# EasyEDA Pro project ProPrj_New Project_2025-04-16_15-56-37_2025-04-18.epro

# Schematic Schematic1
Board Name: Board1; Create Date: 2025-04-16; Page Name: P1; Project Name: New Project_2025-04-16_15-56-37; Schematic Name: Schematic1; Update Date: 2025-04-17; Company: 嘉立创EDA; Page Size: A4; Version: V1.0
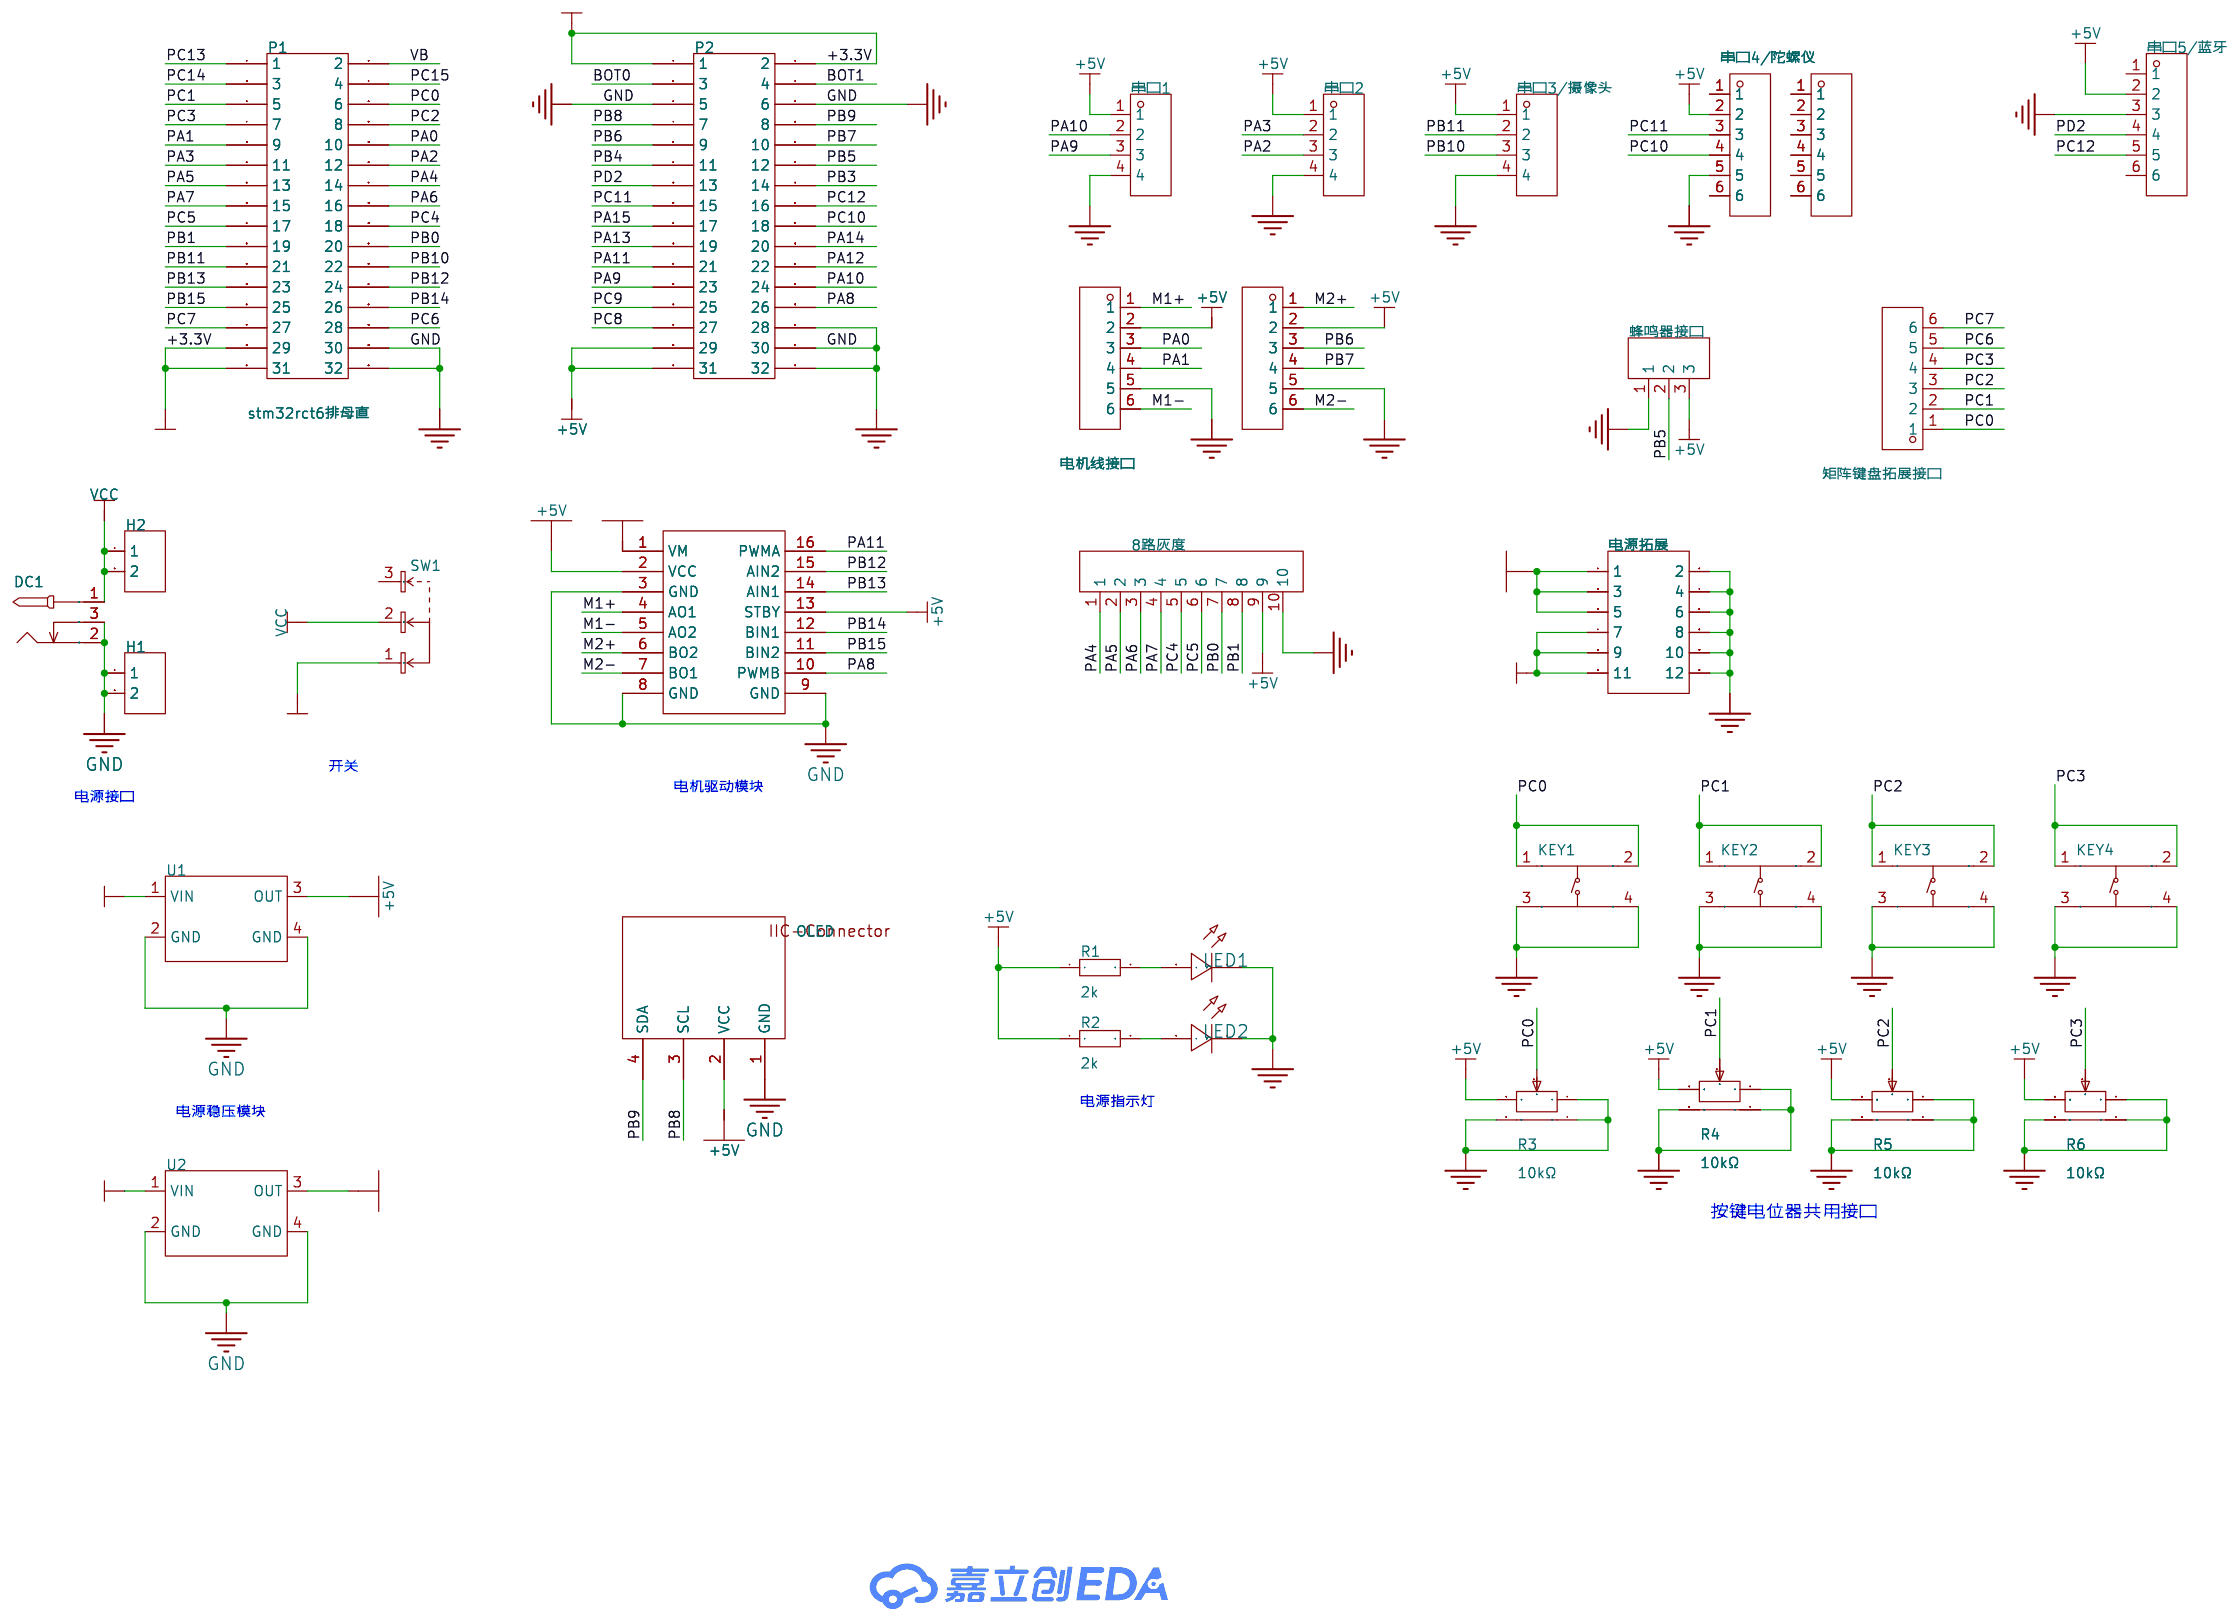
[diagram p0: schematic sheet]

## Parts
8路灰度  -  [HDR-TH_10P-P2.54-V-F]
DC1  -  [DC-005_2.5]
H1  -  [HDR-TH_2P-P2.54-V-F]
H2  -  [HDR-TH_2P-P2.54-V-F]
H8  -  [HDR-TH_6P-P2.54-V-F]
KEY1  TS665CJ  [SW-TH_4P-L6.0-W6.0-P4.50-LS6.5]
KEY2  TS665CJ  [SW-TH_4P-L6.0-W6.0-P4.50-LS6.5]
KEY3  TS665CJ  [SW-TH_4P-L6.0-W6.0-P4.50-LS6.5]
KEY4  TS665CJ  [SW-TH_4P-L6.0-W6.0-P4.50-LS6.5]
LED1  -  [LED_0603]
LED2  -  [LED_0603]
OLED  -  [0.96OLED_4P]
P1  stm32rct6排母直  [HDR-TH_32P-P2.54-V-F-R2-C16-S2.54]
P2  stm32rct6排母直  [HDR-TH_32P-P2.54-V-F-R2-C16-S2.54]
R1  2k  [R0603]
R2  2k  [R0603]
R3  10kΩ  [RV0932电位器]
R4  10kΩ  [RV0932电位器]
R5  10kΩ  [RV0932电位器]
R6  10kΩ  [RV0932电位器]
SW1  SS-12D06L5  [SW-TH_3P-P4.70_L11.1-W12.7]
U1  -  [MP1584模块]
U2  -  [MP1584模块]
U3  PH2.0-6P  [PH2.0-6P 直针端子座]
U5  -  [TB6612FNG Module - 8pin x 2]
串口1  -  [HDR-TH_4P-P2.54-V-F]
串口2  -  [HDR-TH_4P-P2.54-V-F]
串口3/摄像头  -  [HDR-TH_4P-P2.54-V-F]
串口4/陀螺仪  -  [HDR-TH_6P-P2.54-V-F]
串口5/蓝牙  -  [HDR-TH_6P-P2.54-V-F]
电机线接口  PH2.0-6P  [PH2.0-6P 直针端子座]
电源拓展  -  [HDR-TH_12P-P2.54-V-M-R2-C6-S2.54]
矩阵键盘拓展接口  -  [HDR-TH_6P-P2.54-V-F]
蜂鸣器接口  -  [HDR-TH_3P-P2.54-V-F]

## Library data of the parts
8路灰度 = HDR-F_2.54_1x10P: Supplier Part: C2684744; Supplier Footprint: 插件
DC1 = DC-005_2.5: Supplier Footprint: 插件
H1 H2 = HDR-F_2.54_1x2P: Supplier Part: C49661; Supplier Footprint: 插件
H8 串口4/陀螺仪 串口5/蓝牙 矩阵键盘拓展接口 = HDR-F_2.54_1x6P: Supplier Part: C40877; Supplier Footprint: 插件
KEY1-KEY4 = TS665CJ: 电路结构:单刀单掷;按钮形状:圆形按钮;安装方式:直插;开关长度:6mm;开关宽度:6mm;开关高度:5mm;触点电流:50mA;额定电压(DC):12V;带灯:-;机械寿命:-;; LCSC Part Name: 6*6*5mm 直插 轻触开关; Supplier Part: C393938; Manufacturer: SHOU HAN(首韩); Supplier Footprint: 插件; JLCPCB Part Class: 扩展库; Datasheet: https://atta.szlcsc.com/upload/public/pdf/source/20190521/C393938_BDABEAC600B4C55E200A80AA129B70BC.pdf; Supplier: LCSC; Circuit: 单刀单掷; Actuator Style: 圆形按钮; Mounting Style: 直插; Switch Length: 6mm; Switch Width: 6mm; Switch Height: 5mm; Contact Current: 50mA; Voltage Rating (DC): 12V
LED1 LED2 = LED_0603-R: Supplier Footprint: 0603
OLED = 0.96OLED_4P: LCSC Part Name: 0.96OLED_4P_MODULE_JX; Supplier Part: C9900004566; Manufacturer Part: 0.96OLED_4P_MODULE_JX; Supplier Footprint: THrough hole; JLCPCB Part Class: Extended Part; Supplier: LCSC
P1 P2 = 2.54mm,2×16双排排母直: 圆针/方针:-;额定电流:-;额定电压:-;配合针长度:-;塑高:-;触头材质:-;; Supplier Part: C55795; Supplier Footprint: 2.54mm; JLCPCB Part Class: 扩展库; Supplier: LCSC
R1 R2 = Res_0603: Supplier Footprint: 0603
R3-R6 = RK09K1130AP5: 阻值:10kΩ;精度:±20%;功率:50mW;; LCSC Part Name: 10kΩ ±20%; Supplier Part: C470295; Manufacturer: ALPSALPINE(阿尔卑斯阿尔派); Supplier Footprint: 插件; JLCPCB Part Class: 扩展库; Datasheet: https://atta.szlcsc.com/upload/public/pdf/source/20191216/C470452_A95F493F84F2A4E5D2456A617FF6269D.pdf; Supplier: LCSC; Tolerance: ±20%; Rated Voltage: 20V; Power(Watts): 50mW
SW1 = SS-12D06L5: 电路结构:单刀双掷;安装方式:侧插;开关颜色:黑色;额定电流(DC):3A;额定电压(DC):250V;额定电流(AC):3A;额定电压(AC):250V;机械寿命:1万次;; LCSC Part Name: 柄长5mm 卧插双档 滑动开关; Supplier Part: C319015; Manufacturer: XKB Connectivity(中国星坤); Supplier Footprint: 插件; JLCPCB Part Class: 扩展库; Datasheet: https://atta.szlcsc.com/upload/public/pdf/source/20211009/0D67854FD60FB1F6FE75130AD47C052C.pdf; Supplier: LCSC; Circuit: 单刀双掷; Actuator Style: 矩形柱状; Pin Style: PC引脚; Switch Length: 12.95mm; Switch Width: 6.6mm; Switch Height: 6.3mm; Mounting Style: 侧插; Actuator Color: 黑色; Current Rating (DC): 3A; Voltage Rating (DC): 250V; Current Rating (AC): 3A; Voltage Rating (AC): 250V; Mechanical Life: 1万次; Operating Temperature: -40℃~+85℃
U1 U2 = MP1584模块: Pin Type: IN
U3 电机线接口 = PH2.0-6P: Pin Type: IN; Supplier: LCSC; Supplier Part: C722763; Manufacturer: CAX(创都); Manufacturer Part: PH2.0-4P; JLCPCB Part Class: Extended Part
U5 = TB6612FNG模块: Pin Type: In
串口1 串口2 串口3/摄像头 = HDR-F_2.54_1x4P: Supplier Part: C2718488; Supplier Footprint: 插件
电源拓展 = HDR-F_2.54_2x6
蜂鸣器接口 = HDR-F_2.54_1x3P: Supplier Part: C541850; Supplier Footprint: 插件

## Nets
5V: U2.3(OUT) 电源拓展.1 电源拓展.3 电源拓展.5
+3.3V: P1.29 P1.31 P2.1 P2.2 电源拓展.7 电源拓展.9 电源拓展.11
+5V: 8路灰度.9 OLED.2(VCC) P2.29 P2.31 R1.1 R2.1 R3.3 R4.3 R5.3 R6.3 U1.3(OUT) U3.2 U5.2(VCC) U5.13(STBY) 串口1.1 串口2.1 串口3/摄像头.1 串口4/陀螺仪.2 串口5/蓝牙.2 电机线接口.2 蜂鸣器接口.3
+12V: SW1.1 U1.1(VIN) U2.1(VIN) U5.1(VM)
GND: 8路灰度.10 DC1.2 DC1.3 H1.1 H1.2 KEY1.3(C) KEY1.4(D) KEY2.3(C) KEY2.4(D) KEY3.3(C) KEY3.4(D) KEY4.3(C) KEY4.4(D) LED1.1(C) LED2.1(C) OLED.1(GND) P1.30 P1.32 P2.5 P2.6 P2.28 P2.30 P2.32 R3.1 R3.4 R3.5 R4.1 R4.4 R4.5 R5.1 R5.4 R5.5 R6.1 R6.4 R6.5 U1.2(GND) U1.4(GND) U2.2(GND) U2.4(GND) U3.5 U5.3(GND) U5.8(GND) U5.9(GND) 串口1.4 串口2.4 串口3/摄像头.4 串口4/陀螺仪.5 串口5/蓝牙.3 电机线接口.5 电源拓展.2 电源拓展.4 电源拓展.6 电源拓展.8 电源拓展.10 电源拓展.12 蜂鸣器接口.1
VCC: DC1.1(4) H2.1 H2.2 SW1.2
BOT0: P2.3
BOT1: P2.4
M1+: U3.1 U5.4(AO1)
M1-: U3.6 U5.5(AO2)
M2+: U5.6(BO2) 电机线接口.1
M2-: U5.7(BO1) 电机线接口.6
PA0: P1.10 U3.3
PA1: P1.9 U3.4
PA2: P1.12 串口2.3
PA3: P1.11 串口2.2
PA4: 8路灰度.1 P1.14
PA5: 8路灰度.2 P1.13
PA6: 8路灰度.3 P1.16
PA7: 8路灰度.4 P1.15
PA8: P2.26 U5.10(PWMB)
PA9: P2.23 串口1.3
PA10: P2.24 串口1.2
PA11: P2.21 U5.16(PWMA)
PA12: P2.22
PA13: P2.19
PA14: P2.20
PA15: P2.17
PB0: 8路灰度.7 P1.20
PB1: 8路灰度.8 P1.19
PB3: P2.14
PB4: P2.11
PB5: P2.12 蜂鸣器接口.2
PB6: P2.9 电机线接口.3
PB7: P2.10 电机线接口.4
PB8: OLED.3(SCL) P2.7
PB9: OLED.4(SDA) P2.8
PB10: P1.22 串口3/摄像头.3
PB11: P1.21 串口3/摄像头.2
PB12: P1.24 U5.15(AIN2)
PB13: P1.23 U5.14(AIN1)
PB14: P1.26 U5.12(BIN1)
PB15: P1.25 U5.11(BIN2)
PC0: KEY1.1(A) KEY1.2(B) P1.6 R3.2 矩阵键盘拓展接口.1
PC1: KEY2.1(A) KEY2.2(B) P1.5 R4.2 矩阵键盘拓展接口.2
PC2: KEY3.1(A) KEY3.2(B) P1.8 R5.2 矩阵键盘拓展接口.3
PC3: KEY4.1(A) KEY4.2(B) P1.7 R6.2 矩阵键盘拓展接口.4
PC4: 8路灰度.5 P1.18
PC5: 8路灰度.6 P1.17
PC6: P1.28 矩阵键盘拓展接口.5
PC7: P1.27 矩阵键盘拓展接口.6
PC8: P2.27
PC9: P2.25
PC10: P2.18 串口4/陀螺仪.4
PC11: P2.15 串口4/陀螺仪.3
PC12: P2.16 串口5/蓝牙.5
PC13: P1.1
PC14: P1.3
PC15: P1.4
PD2: P2.13 串口5/蓝牙.4
VB: P1.2
$1N9020: LED1.2(A) R1.2
$1N9024: LED2.2(A) R2.2

Not connected (* = marked no-connect by the designer): H8 1 2 3 4 5 6; SW1 3; 串口4/陀螺仪 1 6; 串口5/蓝牙 1 6

## Notes on the sheet
- 开关
- 电源接口
- 电机驱动模块
- 电源稳压模块
- 电源指示灯
- 按键电位器共用接口

# Board PCB1
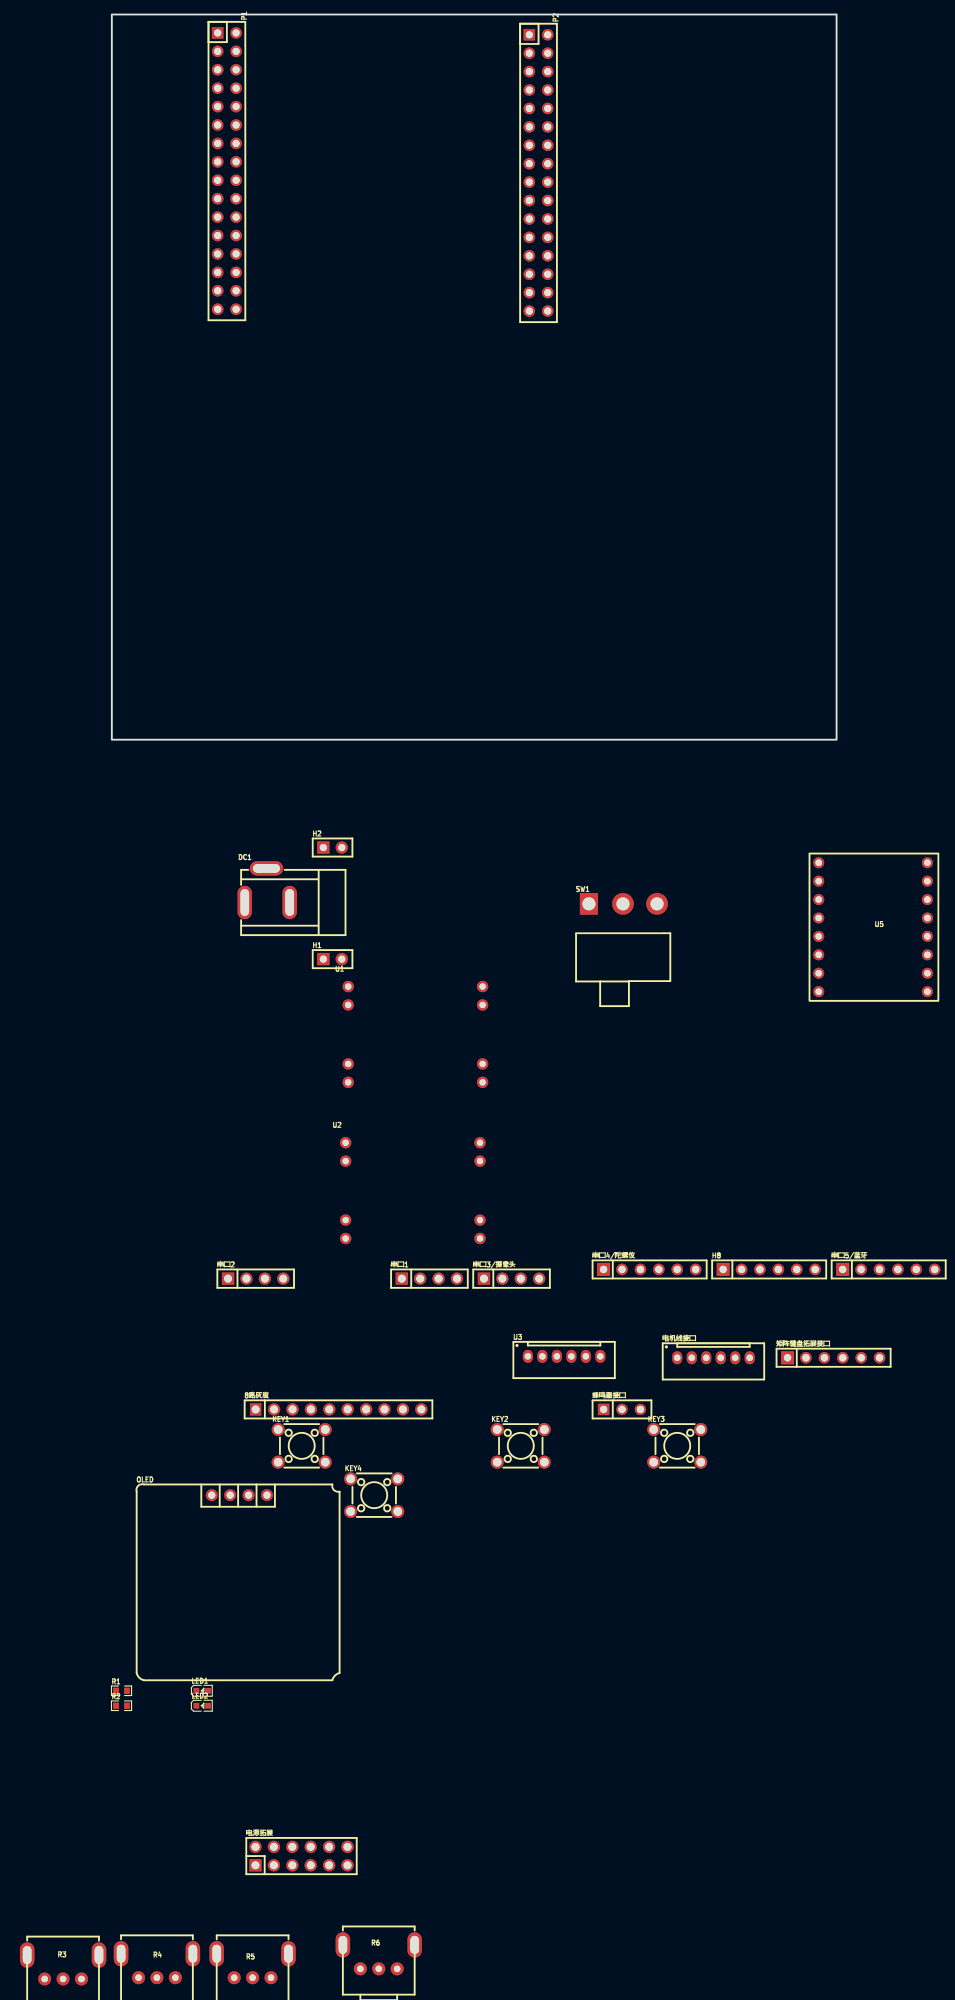
[diagram p1: board, top side]
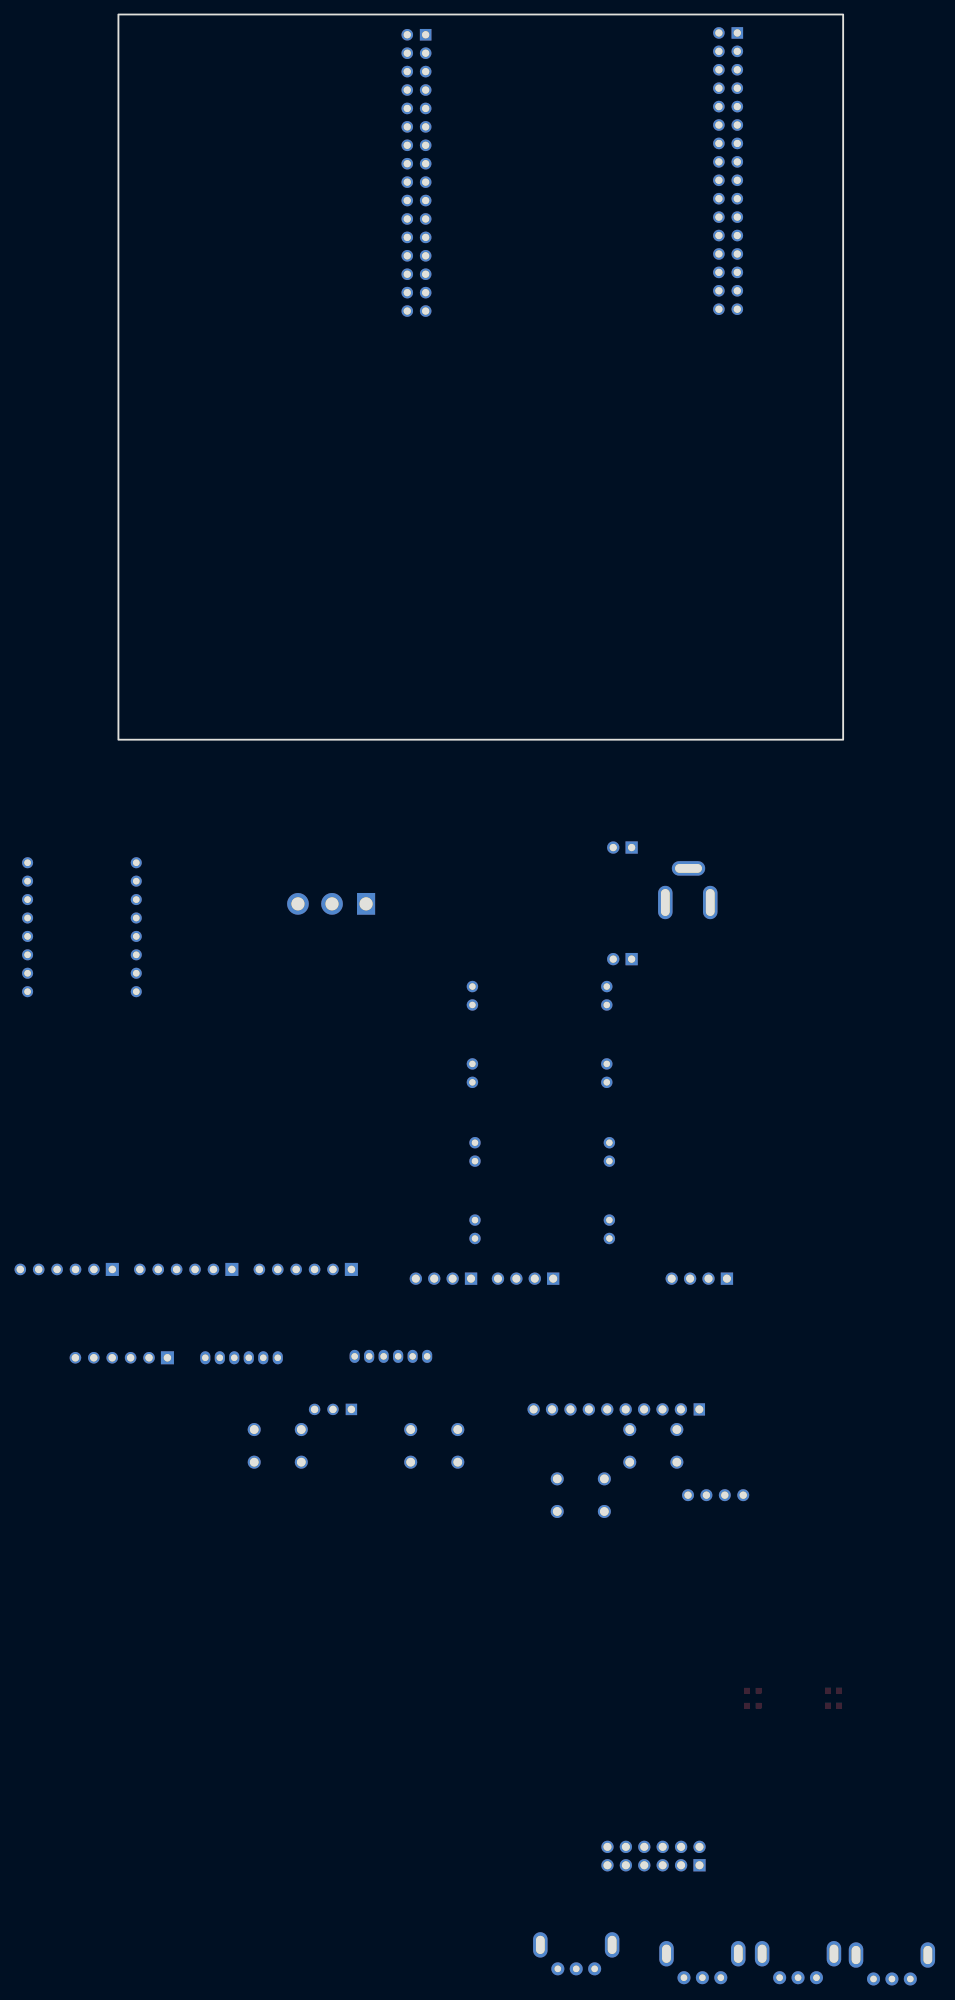
[diagram p2: board, bottom side, seen from below]

Outline 100 x 100 mm; copper layers: Top Layer, Bottom Layer. Coordinates in mm from the lower left corner of the outline.
Outline path: rectangle 0,100 100,0
Stack: Top Layer 0.035mm / Dielectric1 1.51mm FR4 er 4.5 / Bottom Layer 0.035mm

## Design rules (mm)
template: JLCPCB Capability(Two Layers Board)
spacing copperThickness1oz (default): track to track 0.102, other pairs 0.152 to 0.3
spacing copperThickness2oz: track to track 0.203, other pairs 0.152 to 0.3
track width copperThickness1oz (default): min 0.127, default 0.254, max 2.54
track width copperThickness2oz: min 0.203, default 0.254, max 2.54
differential pair differentialPair (default): width min 0.127, default 0.254, max 2.54; gap min 0.152, default 0.152
via viaSize (default): diameter min 0.5, default 0.61, max 10; hole min 0.3, default 0.305, max 6.3

## Placement (name value [footprint] x y rotation side)
8路灰度  -  [HDR-TH_10P-P2.54-V-F]  31.28 -92.35 0 top
DC1  -  [DC-005_2.5]  21.56 -22.13 0 top
H1  -  [HDR-TH_2P-P2.54-V-F]  30.45 -30.26 0 top
H2  -  [HDR-TH_2P-P2.54-V-F]  30.45 -14.87 0 top
H8  -  [HDR-TH_6P-P2.54-V-F]  90.7 -73.05 0 top
KEY1  TS665CJ  [SW-TH_4P-L6.0-W6.0-P4.50-LS6.5]  26.2 -97.38 0 top
KEY2  TS665CJ  [SW-TH_4P-L6.0-W6.0-P4.50-LS6.5]  56.42 -97.38 0 top
KEY3  TS665CJ  [SW-TH_4P-L6.0-W6.0-P4.50-LS6.5]  78.01 -97.38 0 top
KEY4  TS665CJ  [SW-TH_4P-L6.0-W6.0-P4.50-LS6.5]  36.2 -104.18 0 top
LED1  -  [LED_0603]  12.52 -131.15 0 top
LED2  -  [LED_0603]  12.52 -133.21 0 top
OLED  -  [0.96OLED_4P]  17.6 -104.18 0 top
P1  stm32rct6排母直  [HDR-TH_32P-P2.54-V-F-R2-C16-S2.54]  15.88 78.41 270 top
P2  stm32rct6排母直  [HDR-TH_32P-P2.54-V-F-R2-C16-S2.54]  58.88 78.16 270 top
R1  2k  [R0603]  1.33 -131.15 0 top
R2  2k  [R0603]  1.33 -133.21 0 top
R3  10kΩ  [RV0932电位器]  -6.73 -170.89 0 top
R4  10kΩ  [RV0932电位器]  6.22 -170.71 0 top
R5  10kΩ  [RV0932电位器]  19.42 -170.71 0 top
R6  10kΩ  [RV0932电位器]  36.83 -169.49 0 top
SW1  SS-12D06L5  [SW-TH_3P-P4.70_L11.1-W12.7]  70.53 -22.64 0 top
U1  -  [MP1584模块]  41.88 -40.65 0 top
U2  -  [MP1584模块]  41.53 -62.18 0 top
U3  PH2.0-6P  [PH2.0-6P 直针端子座]  57.4 -85.04 0 top
U5  -  [TB6612FNG Module - 8pin x 2]  105.16 -25.86 0 top
串口1  -  [HDR-TH_4P-P2.54-V-F]  43.82 -74.32 0 top
串口2  -  [HDR-TH_4P-P2.54-V-F]  19.85 -74.32 0 top
串口3/摄像头  -  [HDR-TH_4P-P2.54-V-F]  55.15 -74.32 0 top
串口4/陀螺仪  -  [HDR-TH_6P-P2.54-V-F]  74.2 -73.05 0 top
串口5/蓝牙  -  [HDR-TH_6P-P2.54-V-F]  107.19 -73.05 0 top
电机线接口  PH2.0-6P  [PH2.0-6P 直针端子座]  78.01 -85.23 0 top
电源拓展  -  [HDR-TH_12P-P2.54-V-M-R2-C6-S2.54]  26.17 -153.94 0 top
矩阵键盘拓展接口  -  [HDR-TH_6P-P2.54-V-F]  99.59 -85.23 0 top
蜂鸣器接口  -  [HDR-TH_3P-P2.54-V-F]  70.39 -92.35 0 top

## Footprints (pads in the part's own frame, mm; a bottom-side part is the same pattern mirrored in y, then rotated)
0.96OLED_4P
  round 1.651 hole 1.001: 1(-3.81,0) 2(-1.27,0.003) 3(1.27,0.003) 4(3.81,0.003)
DC-005_2.5
  oval 2x4.6 hole 1.2x3.7: 1(-3.227,-0.318) 2(2.973,-0.318)
  oval 4.6x2 hole 3.7x1.2: 3(-0.227,4.382)
HDR-TH_2P-P2.54-V-F
  rect 1.7x1.7 hole 1: 1(-1.27,0)
  round 1.7 hole 1: 2(1.27,0)
HDR-TH_3P-P2.54-V-F
  rect 1.575x1.575 hole 1.02: 1(-2.54,0)
  round 1.575 hole 1.02: 2(0,0) 3(2.54,0)
HDR-TH_4P-P2.54-V-F
  rect 1.7x1.7 hole 1.1: 1(-3.81,0)
  round 1.7 hole 1.1: 2(-1.27,0) 3(1.27,0) 4(3.81,0)
HDR-TH_6P-P2.54-V-F
  rect 1.8x1.8 hole 1.02: 1(-6.35,0)
  round 1.6 hole 1.02: 2(-3.81,0) 3(-1.27,0) 4(1.27,0) 5(3.81,0) 6(6.35,0)
HDR-TH_10P-P2.54-V-F
  rect 1.575x1.7 hole 1.1: 1(-11.43,0)
  round 1.7 hole 1.1: 2(-8.89,0) 3(-6.35,0) 4(-3.81,0) 5(-1.27,0) 6(1.27,0) 7(3.81,0) 8(6.35,0) 9(8.89,0) 10(11.43,0)
HDR-TH_12P-P2.54-V-M-R2-C6-S2.54
  rect 1.7x1.7 hole 1.1: 1(-6.35,-1.27)
  round 1.7 hole 1.1: 2(-6.35,1.27) 3(-3.81,-1.27) 4(-3.81,1.27) 5(-1.27,-1.27) 6(-1.27,1.27) 7(1.27,-1.27) 8(1.27,1.27) 9(3.81,-1.27) 10(3.81,1.27) 11(6.35,-1.27) 12(6.35,1.27)
HDR-TH_32P-P2.54-V-F-R2-C16-S2.54
  rect 1.6x1.6 hole 1: 1(-19.05,-1.27)
  round 1.6 hole 1: 2(-19.05,1.27) 3(-16.51,-1.27) 4(-16.51,1.27) 5(-13.97,-1.27) 6(-13.97,1.27) 7(-11.43,-1.27) 8(-11.43,1.27) 9(-8.89,-1.27) 10(-8.89,1.27) 11(-6.35,-1.27) 12(-6.35,1.27) 13(-3.81,-1.27) 14(-3.81,1.27) 15(-1.27,-1.27) 16(-1.27,1.27) 17(1.27,-1.27) 18(1.27,1.27) 19(3.81,-1.27) 20(3.81,1.27) 21(6.35,-1.27) 22(6.35,1.27) 23(8.89,-1.27) 24(8.89,1.27) 25(11.43,-1.27) 26(11.43,1.27) 27(13.97,-1.27) 28(13.97,1.27) 29(16.51,-1.27) 30(16.51,1.27) 31(19.05,-1.27) 32(19.05,1.27)
LED_0603
  rect 0.8x0.8 smd: 1(-0.851,-0.01) 2(0.75,-0.005)
MP1584模块
  round 1.575 hole 0.889: 1(-9.271,-4.064) 1(-9.271,-6.604) 2(-9.271,6.604) 2(-9.271,4.064) 3(9.271,-4.064) 3(9.271,-6.604) 4(9.271,6.604) 4(9.271,4.064)
PH2.0-6P 直针端子座
  oval 1.4x1.8 hole 0.9: 1(0,0) 2(2,0) 3(4,0) 4(6,0) 5(8,0) 6(10,0)
R0603
  rect 0.806x0.864 smd: 1(-0.753,0) 2(0.753,0)
RV0932电位器
  round 1.8 hole 0.914: 1(-2.54,0) 2(0,0) 3(2.54,0)
  oval 2x3.5 hole 1.2x2.5: 4(-4.953,3.302) 4(4.953,3.302)
SW-TH_3P-P4.70_L11.1-W12.7
  rect 2.5x3 hole 1.8: 1(-4.7,0)
  round 3 hole 1.8: 2(0,0) 3(4.7,0)
SW-TH_4P-L6.0-W6.0-P4.50-LS6.5
  round 1.8 hole 1.2: 1(-3.25,2.25) 2(3.25,2.25) 3(-3.25,-2.25) 4(3.25,-2.25)
TB6612FNG Module - 8pin x 2
  round 1.524 hole 0.914: 1(-7.62,8.89) 2(-7.62,6.35) 3(-7.62,3.81) 4(-7.62,1.27) 5(-7.62,-1.27) 6(-7.62,-3.81) 7(-7.62,-6.35) 8(-7.62,-8.89) 9(7.38,-8.89) 10(7.38,-6.35) 11(7.38,-3.81) 12(7.38,-1.27) 13(7.38,1.27) 14(7.38,3.81) 15(7.38,6.35) 16(7.38,8.89)

## Nets
5V: U2.3 电源拓展.1 电源拓展.3 电源拓展.5
+3.3V: P1.29 P1.31 P2.1 P2.2 电源拓展.7 电源拓展.9 电源拓展.11
+5V: 8路灰度.9 OLED.2 P2.29 P2.31 R1.1 R2.1 R3.3 R4.3 R5.3 R6.3 U1.3 U3.2 U5.2 U5.13 串口1.1 串口2.1 串口3/摄像头.1 串口4/陀螺仪.2 串口5/蓝牙.2 电机线接口.2 蜂鸣器接口.3
+12V: SW1.1 U1.1 U2.1 U5.1
GND: 8路灰度.10 DC1.2 DC1.3 H1.1 H1.2 KEY1.3 KEY1.4 KEY2.3 KEY2.4 KEY3.3 KEY3.4 KEY4.3 KEY4.4 LED1.1 LED2.1 OLED.1 P1.30 P1.32 P2.5 P2.6 P2.28 P2.30 P2.32 R3.1 R3.4 R4.1 R4.4 R5.1 R5.4 R6.1 R6.4 U1.2 U1.4 U2.2 U2.4 U3.5 U5.3 U5.8 U5.9 串口1.4 串口2.4 串口3/摄像头.4 串口4/陀螺仪.5 串口5/蓝牙.3 电机线接口.5 电源拓展.2 电源拓展.4 电源拓展.6 电源拓展.8 电源拓展.10 电源拓展.12 蜂鸣器接口.1
VCC: DC1.1 H2.1 H2.2 SW1.2
BOT0: P2.3
BOT1: P2.4
M1+: U3.1 U5.4
M1-: U3.6 U5.5
M2+: U5.6 电机线接口.1
M2-: U5.7 电机线接口.6
PA0: U3.3
PA1: U3.4
PA4: 8路灰度.1
PA5: 8路灰度.2
PA6: 8路灰度.3
PA7: 8路灰度.4
PA8: U5.10
PA11: U5.16
PA12: P2.22
PA13: P2.19
PA14: P2.20
PA15: P2.17
PB0: 8路灰度.7
PB1: 8路灰度.8
PB3: P2.14
PB4: P2.11
PB5: 蜂鸣器接口.2
PB6: 电机线接口.3
PB7: 电机线接口.4
PB8: OLED.3
PB9: OLED.4
PB12: U5.15
PB13: U5.14
PB14: U5.12
PB15: U5.11
PC0: KEY1.1 KEY1.2 R3.2 矩阵键盘拓展接口.1
PC1: KEY2.1 KEY2.2 R4.2 矩阵键盘拓展接口.2
PC2: KEY3.1 KEY3.2 R5.2 矩阵键盘拓展接口.3
PC3: KEY4.1 KEY4.2 R6.2 矩阵键盘拓展接口.4
PC4: 8路灰度.5
PC5: 8路灰度.6
PC6: 矩阵键盘拓展接口.5
PC7: 矩阵键盘拓展接口.6
PC13: P1.1
PC14: P1.3
PC15: P1.4
VB: P1.2
$1N9020: LED1.2 R1.2
$1N9024: LED2.2 R2.2

Pads without a net: H8 1 2 3 4 5 6; P1 5 6 7 8 9 10 11 12 13 14 15 16 17 18 19 20 21 22 23 24 25 26 27 28; P2 7 8 9 10 12 13 15 16 18 21 23 24 25 26 27; SW1 3; 串口1 2 3; 串口2 2 3; 串口3/摄像头 2 3; 串口4/陀螺仪 1 3 4 6; 串口5/蓝牙 1 4 5 6
